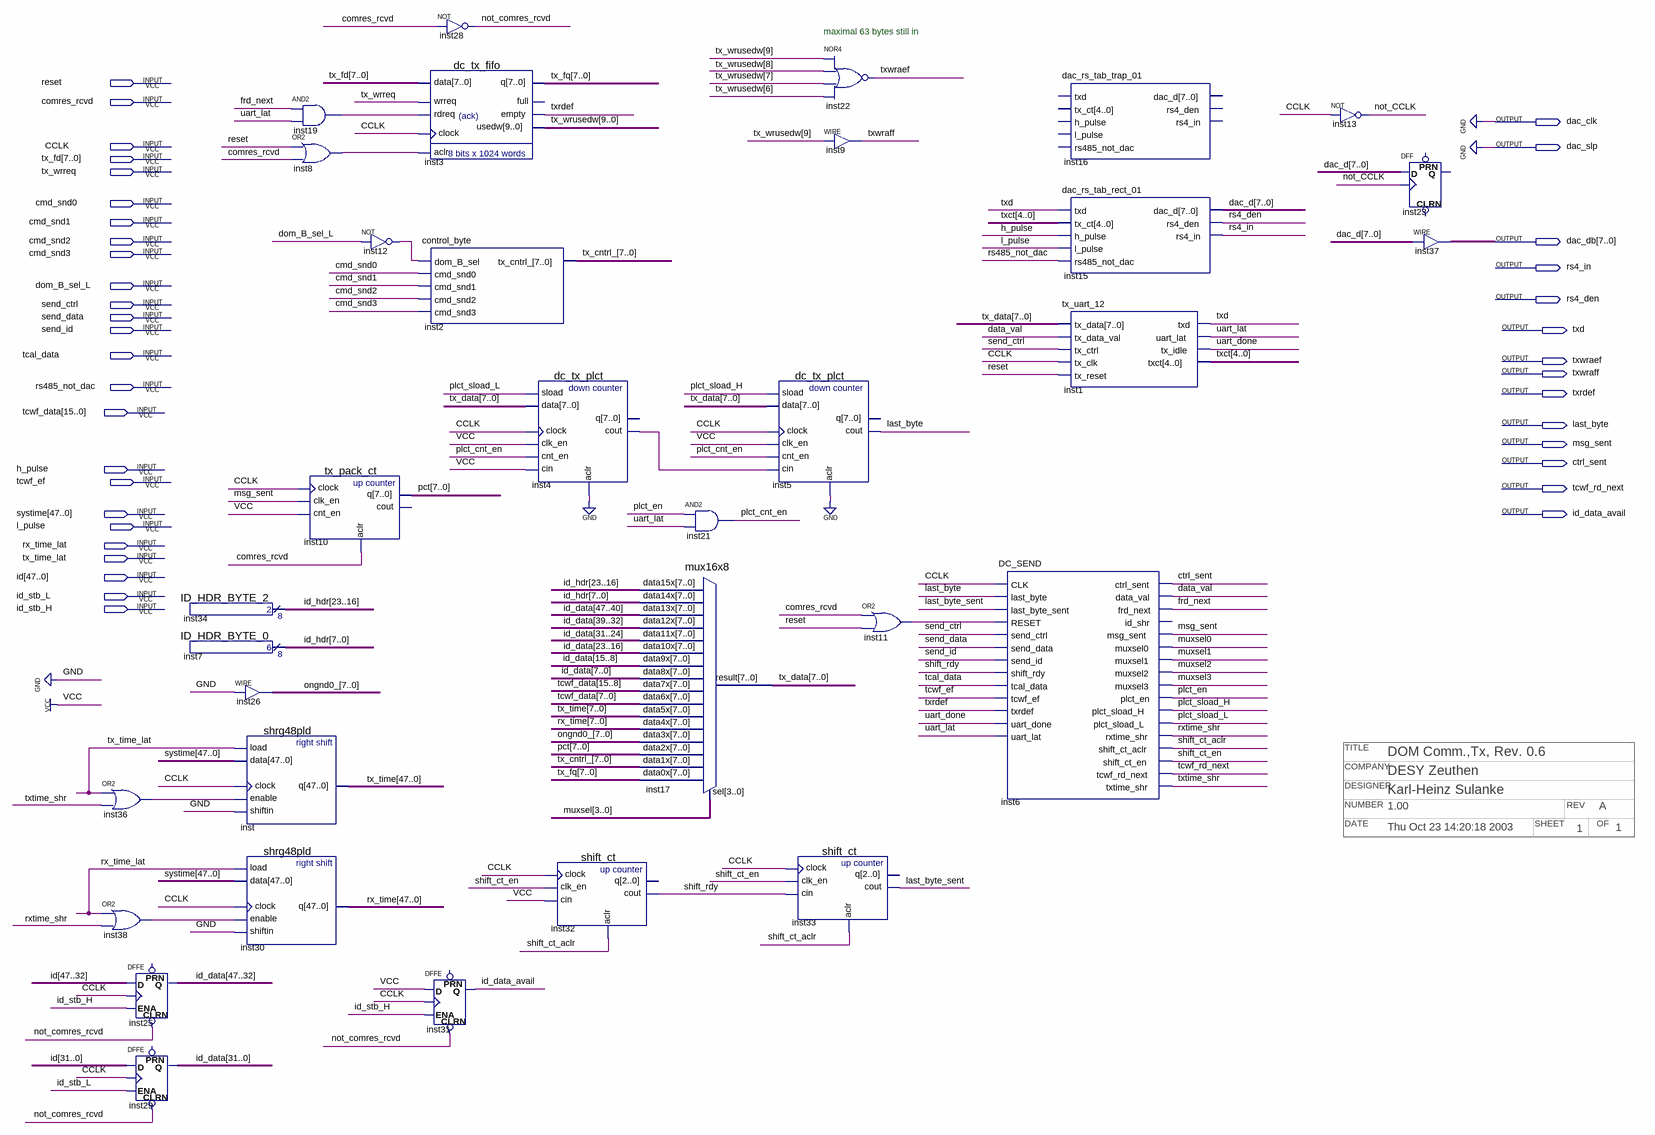
[diagram p0: schematic sheet]
// Quartus schematic DC_Tx_chan_04_fifo.bdf as structural Verilog: 33 symbols, 39 pins
// Title block: TITLE: DOM Comm.,Tx, Rev. 0.6; COMPANY: DESY Zeuthen; DESIGNER: Karl-Heinz Sulanke; NUMBER: 1.00; REV: A; DATE: Thu Oct 23 14:20:18 2003; SHEET: 1; OF: 1
module DC_Tx_chan_04_fifo (
  input  reset,
  input  comres_rcvd,
  input  CCLK,
  input  [7:0] tx_fd,
  input  tx_wrreq,
  input  cmd_snd0,
  input  cmd_snd1,
  input  cmd_snd2,
  input  cmd_snd3,
  input  dom_B_sel_L,
  input  send_ctrl,
  input  send_data,
  input  send_id,
  input  tcal_data,
  input  rs485_not_dac,
  input  [15:0] tcwf_data,
  input  h_pulse,
  input  tcwf_ef,
  input  [47:0] systime,
  input  l_pulse,
  input  rx_time_lat,
  input  tx_time_lat,
  input  [47:0] id,
  input  id_stb_L,
  input  id_stb_H,
  output dac_clk,
  output dac_slp,
  output [7:0] dac_db,
  output rs4_in,
  output rs4_den,
  output txd,
  output txwraef,
  output txwraff,
  output txrdef,
  output last_byte,
  output msg_sent,
  output ctrl_sent,
  output tcwf_rd_next,
  output id_data_avail
);

  wire data_val, frd_next, inst4_cout, inst8_out, inst11_out, inst12_out, inst19_out, inst36_out, inst38_out,
       last_byte_sent, not_CCLK, not_comres_rcvd, plct_cnt_en, plct_en, plct_sload_H, plct_sload_L,
       rxtime_shr, shift_ct_aclr, shift_ct_en, shift_rdy, txtime_shr, uart_done, uart_lat;
  wire [3:0] muxsel;
  wire [4:0] txct;
  wire [7:0] dac_d, ongnd0_, pct, tx_cntrl_, tx_data, tx_fq;
  wire [9:0] tx_wrusedw;
  wire [23:0] id_hdr;
  wire [47:0] id_data, rx_time, tx_time;

  or inst36 (inst36_out, tx_time_lat, txtime_shr);
  or inst38 (inst38_out, rx_time_lat, rxtime_shr);
  DFFE inst25[15:0] (
    .CLRN(not_comres_rcvd), .D(id[47:32]), .CLK(CCLK), .ENA(id_stb_H), .Q(id_data[47:32]));  // open: PRN
  DFFE inst29[31:0] (.CLRN(not_comres_rcvd), .D(id[31:0]), .CLK(CCLK), .ENA(id_stb_L), .Q(id_data[31:0]));  // open: PRN
  ID_HDR_BYTE_2 inst34 (.result(id_hdr[23:16]));
  ID_HDR_BYTE_0 inst7 (.result(id_hdr[7:0]));
  assign ongnd0_ = {8{1'b0}};  // WIRE inst26
  shrg48pld inst (.load(tx_time_lat), .data(systime), .clock(CCLK), .enable(inst36_out), .shiftin(1'b0), .q(tx_time));
  shrg48pld inst30 (.load(rx_time_lat), .data(systime), .clock(CCLK), .enable(inst38_out), .shiftin(1'b0), .q(rx_time));
  and inst19 (inst19_out, frd_next, uart_lat);
  or inst8 (inst8_out, reset, comres_rcvd);
  tx_pack_ct inst10 (.clock(CCLK), .clk_en(msg_sent), .cnt_en(1'b1), .aclr(comres_rcvd), .q(pct));  // open: cout
  not inst12 (inst12_out, dom_B_sel_L);
  dc_tx_fifo inst3 (
    .data(tx_fd), .wrreq(tx_wrreq), .rdreq(inst19_out), .clock(CCLK), .aclr(inst8_out), .q(tx_fq),
    .empty(txrdef), .usedw(tx_wrusedw));  // open: full
  control_byte inst2 (
    .dom_B_sel(inst12_out), .cmd_snd0(cmd_snd0), .cmd_snd1(cmd_snd1), .cmd_snd2(cmd_snd2),
    .cmd_snd3(cmd_snd3), .tx_cntrl_(tx_cntrl_));
  DFFE inst31 (.CLRN(not_comres_rcvd), .D(1'b1), .CLK(CCLK), .ENA(id_stb_H), .Q(id_data_avail));  // open: PRN
  not inst28 (not_comres_rcvd, comres_rcvd);
  dc_tx_plct inst4 (
    .sload(plct_sload_L), .data(tx_data), .clock(CCLK), .clk_en(1'b1), .cnt_en(plct_cnt_en), .cin(1'b1),
    .aclr(1'b0), .cout(inst4_cout));  // open: q
  shift_ct inst32 (.clock(CCLK), .clk_en(shift_ct_en), .cin(1'b1), .aclr(shift_ct_aclr), .cout(shift_rdy));  // open: q
  mux16x8 inst17 (
    .data15x(id_hdr[23:16]), .data14x(id_hdr[7:0]), .data13x(id_data[47:40]), .data12x(id_data[39:32]),
    .data11x(id_data[31:24]), .data10x(id_data[23:16]), .data9x(id_data[15:8]), .data8x(id_data[7:0]),
    .data7x(tcwf_data[15:8]), .data6x(tcwf_data[7:0]), .data5x(tx_time[7:0]), .data4x(rx_time[7:0]),
    .data3x(ongnd0_), .data2x(pct), .data1x(tx_cntrl_), .data0x(tx_fq), .sel(muxsel), .result(tx_data));
  and inst21 (plct_cnt_en, plct_en, uart_lat);
  dc_tx_plct inst5 (
    .sload(plct_sload_H), .data(tx_data), .clock(CCLK), .clk_en(1'b1), .cnt_en(plct_cnt_en),
    .cin(inst4_cout), .aclr(1'b0), .cout(last_byte));  // open: q
  nor inst22 (txwraef, tx_wrusedw[9], tx_wrusedw[8], tx_wrusedw[7], tx_wrusedw[6]);
  assign txwraff = tx_wrusedw[9];  // WIRE inst9
  shift_ct inst33 (
    .clock(CCLK), .clk_en(shift_ct_en), .cin(shift_rdy), .aclr(shift_ct_aclr), .cout(last_byte_sent));  // open: q
  or inst11 (inst11_out, comres_rcvd, reset);
  DC_SEND inst6 (
    .CLK(CCLK), .last_byte(last_byte), .last_byte_sent(last_byte_sent), .RESET(inst11_out),
    .send_ctrl(send_ctrl), .send_data(send_data), .send_id(send_id), .shift_rdy(shift_rdy),
    .tcal_data(tcal_data), .tcwf_ef(tcwf_ef), .txrdef(txrdef), .uart_done(uart_done), .uart_lat(uart_lat),
    .ctrl_sent(ctrl_sent), .data_val(data_val), .frd_next(frd_next), .msg_sent(msg_sent),
    .muxsel0(muxsel[0]), .muxsel1(muxsel[1]), .muxsel2(muxsel[2]), .muxsel3(muxsel[3]), .plct_en(plct_en),
    .plct_sload_H(plct_sload_H), .plct_sload_L(plct_sload_L), .rxtime_shr(rxtime_shr),
    .shift_ct_aclr(shift_ct_aclr), .shift_ct_en(shift_ct_en), .tcwf_rd_next(tcwf_rd_next),
    .txtime_shr(txtime_shr));  // open: id_shr
  dac_rs_tab_trap_01 inst16 ();  // open: txd, tx_ct, h_pulse, l_pulse, rs485_not_dac, dac_d, rs4_den, rs4_in
  dac_rs_tab_rect_01 inst15 (
    .txd(txd), .tx_ct(txct), .h_pulse(h_pulse), .l_pulse(l_pulse), .rs485_not_dac(rs485_not_dac),
    .dac_d(dac_d), .rs4_den(rs4_den), .rs4_in(rs4_in));
  tx_uart_12 inst1 (
    .tx_data(tx_data), .tx_data_val(data_val), .tx_ctrl(send_ctrl), .tx_clk(CCLK), .tx_reset(reset),
    .txd(txd), .uart_lat(uart_lat), .tx_idle(uart_done), .txct(txct));
  not inst13 (not_CCLK, CCLK);
  DFF inst23[7:0] (.CLK(not_CCLK), .D(dac_d));  // open: CLRN, PRN, Q
  assign dac_db = dac_d;  // WIRE inst37

  assign dac_clk = 1'b0;
  assign dac_slp = 1'b0;

  // Notes on the sheet:
  //   maximal 63 bytes still in
endmodule
